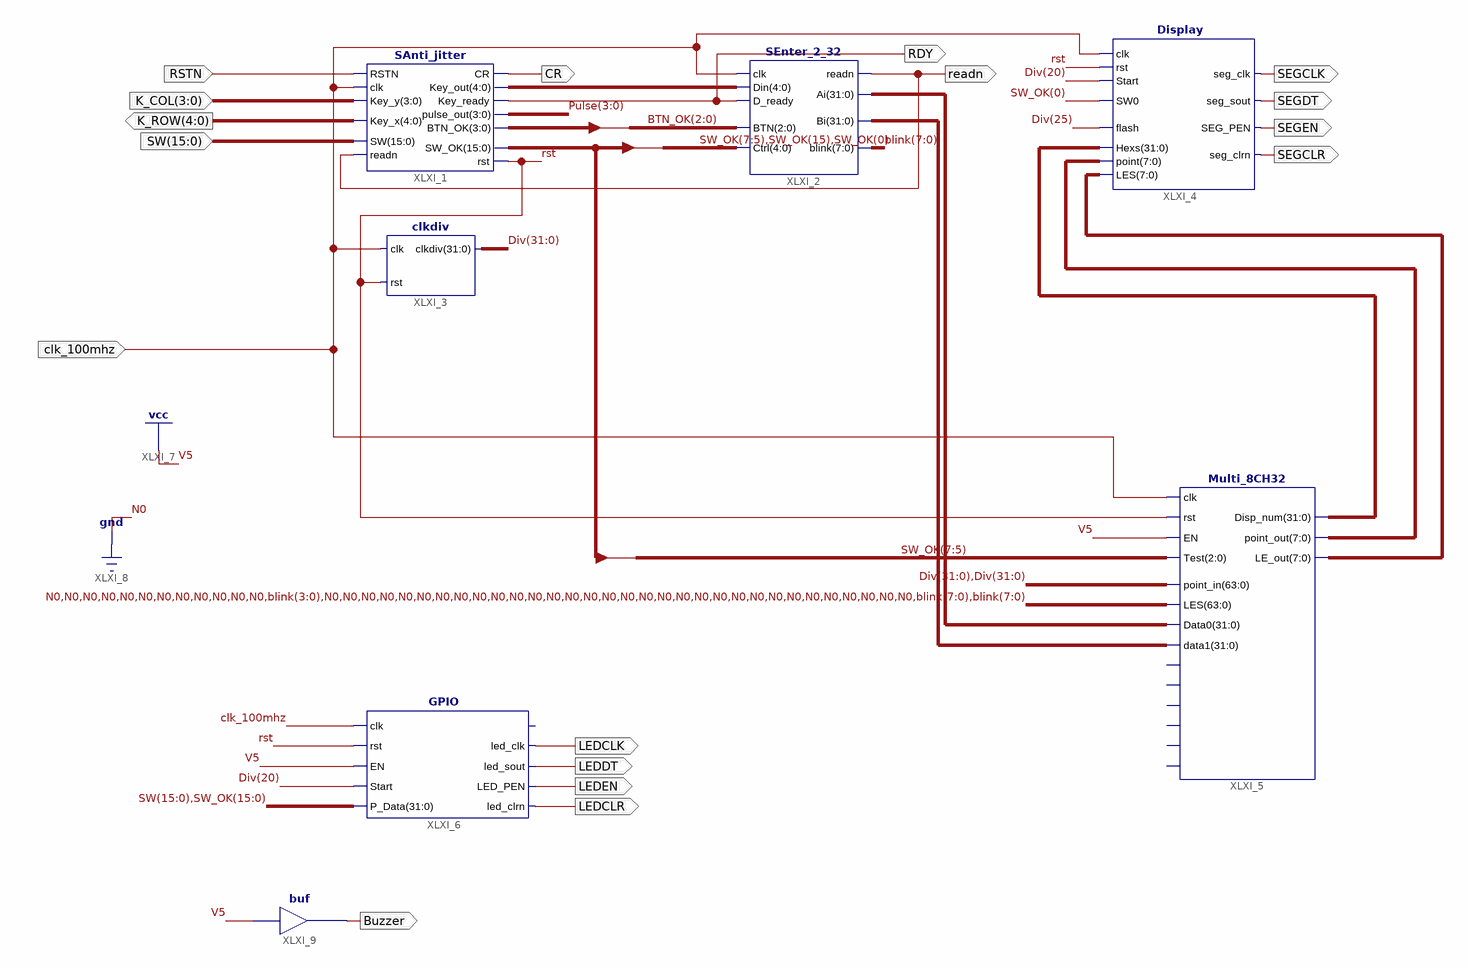
[diagram p0: schematic sheet 1]
// Xilinx ISE schematic framewoek_i2.sch (kintex7) as structural Verilog: 7 symbols, 17 ports
module framewoek_i2 (
  input  RSTN,
  input  clk_100mhz,
  input  [3:0] K_COL,
  input  [15:0] SW,
  output [4:0] K_ROW,
  output readn,
  output CR,
  output RDY,
  output SEGEN,
  output SEGDT,
  output SEGCLR,
  output SEGCLK,
  output LEDCLK,
  output LEDDT,
  output LEDEN,
  output LEDCLR,
  output Buzzer
);

  wire rst;
  wire [3:0] BTN_OK, Pulse;
  wire [4:0] XLXN_10;
  wire [7:0] blink, XLXN_28, XLXN_29;
  wire [15:0] SW_OK;
  wire [31:0] Div, XLXN_26, XLXN_27, XLXN_30;

  SAnti_jitter XLXI_1 (
    .SW(SW), .readn(readn), .Key_y(K_COL), .Key_x(K_ROW), .RSTN(RSTN), .clk(clk_100mhz), .Key_out(XLXN_10),
    .Key_ready(RDY), .CR(CR), .rst(rst), .SW_OK(SW_OK), .pulse_out(Pulse), .BTN_OK(BTN_OK));
  SEnter_2_32 XLXI_2 (
    .readn(readn), .Ai(XLXN_26), .Bi(XLXN_27), .blink(blink), .Din(XLXN_10), .D_ready(RDY), .clk(clk_100mhz),
    .Ctrl({SW_OK[7:5], SW_OK[15], SW_OK[0]}), .BTN(BTN_OK[2:0]));
  clkdiv XLXI_3 (.rst(rst), .clkdiv(Div), .clk(clk_100mhz));
  Display XLXI_4 (
    .LES(XLXN_28), .SEG_PEN(SEGEN), .seg_sout(SEGDT), .seg_clrn(SEGCLR), .point(XLXN_29), .Hexs(XLXN_30),
    .SW0(SW_OK[0]), .flash(Div[25]), .seg_clk(SEGCLK), .clk(clk_100mhz), .rst(rst), .Start(Div[20]));
  Multi_8CH32 XLXI_5 (
    .Test(SW_OK[7:5]), .point_in({Div, Div}), .EN(1'b1), .clk(clk_100mhz), .rst(rst),
    .LES({{12{1'b0}}, blink[3:0], {32{1'b0}}, blink, blink}), .Data0(XLXN_26), .data1(XLXN_27),
    .point_out(XLXN_29), .LE_out(XLXN_28), .Disp_num(XLXN_30));  // open: data2, data3, data4, data5, data6, data7
  GPIO XLXI_6 (
    .clk(clk_100mhz), .P_Data({SW, SW_OK}), .rst(rst), .EN(1'b1), .Start(Div[20]), .led_clrn(LEDCLR),
    .led_clk(LEDCLK), .led_sout(LEDDT), .LED_PEN(LEDEN));  // open: GPIOf0
  buf XLXI_9 (Buzzer, 1'b1);
endmodule
